# EAGLE schematic d-cs-8i-0-27 (EAGLE 6.6.0)
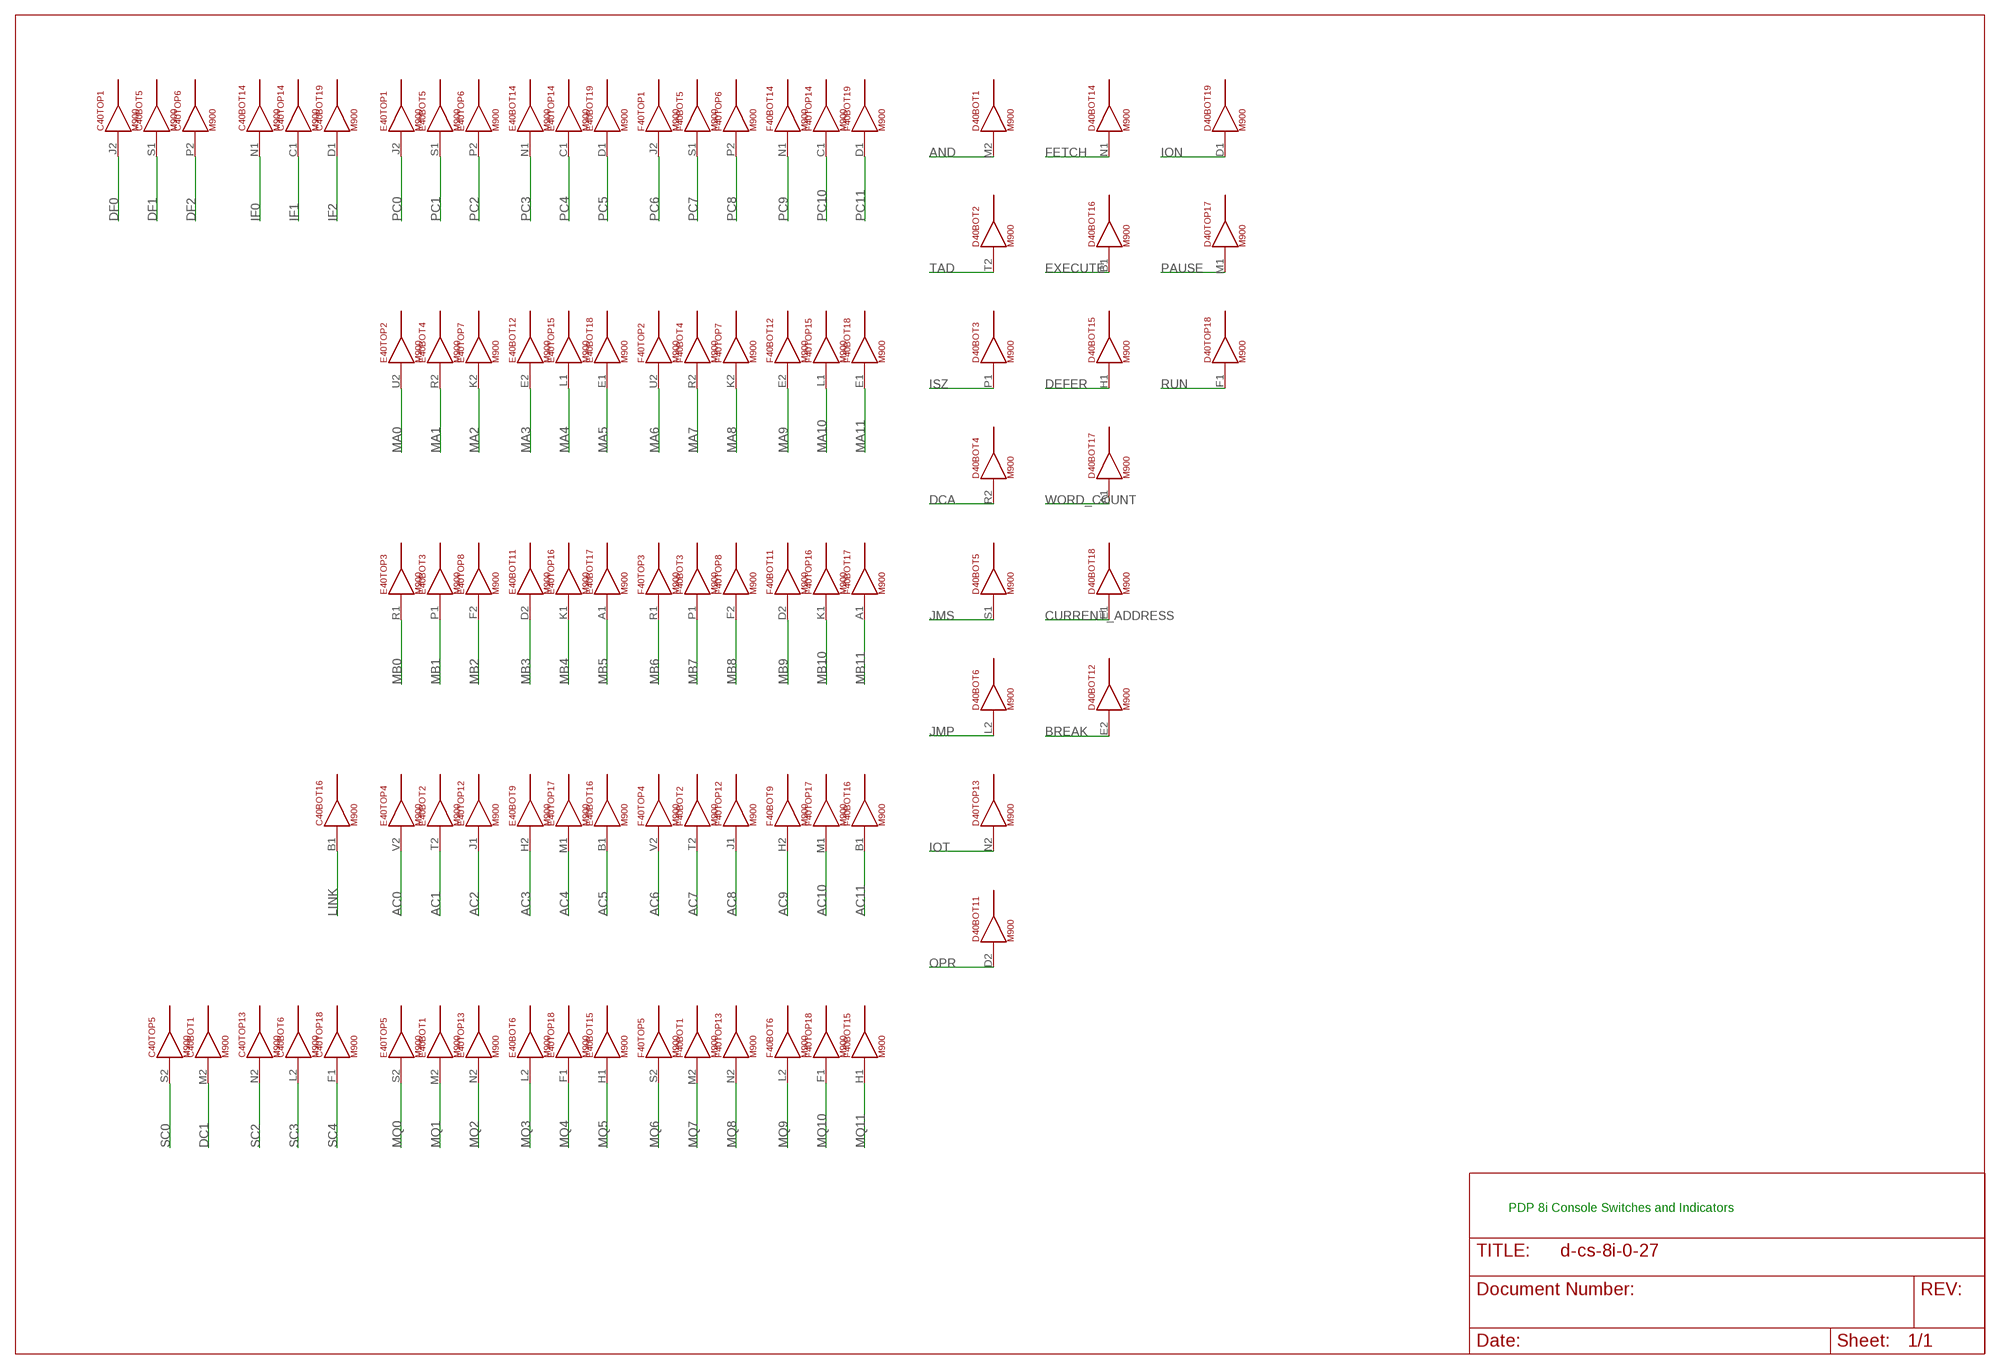
[diagram p0: schematic, sheet 1]

## Parts
C40  M900  [H807]
D40  M900  [H807]
E40  M900  [H807]
F40  M900  [H807]

## Nets
AC0: E40.V2
AC1: E40.T2
AC2: E40.J1
AC3: E40.H2
AC4: E40.M1
AC5: E40.B1
AC6: F40.V2
AC7: F40.T2
AC8: F40.J1
AC9: F40.H2
AC10: F40.M1
AC11: F40.B1
AND: D40.M2
BREAK: D40.E2
CURRENT_ADDRESS: D40.E1
DC1: C40.M2
DCA: D40.R2
DEFER: D40.H1
DF0: C40.J2
DF1: C40.S1
DF2: C40.P2
EXECUTE: D40.B1
FETCH: D40.N1
IF0: C40.N1
IF1: C40.C1
IF2: C40.D1
ION: D40.D1
IOT: D40.N2
ISZ: D40.P1
JMP: D40.L2
JMS: D40.S1
LINK: C40.B1
MA0: E40.U2
MA1: E40.R2
MA2: E40.K2
MA3: E40.E2
MA4: E40.L1
MA5: E40.E1
MA6: F40.U2
MA7: F40.R2
MA8: F40.K2
MA9: F40.E2
MA10: F40.L1
MA11: F40.E1
MB0: E40.R1
MB1: E40.P1
MB2: E40.F2
MB3: E40.D2
MB4: E40.K1
MB5: E40.A1
MB6: F40.R1
MB7: F40.P1
MB8: F40.F2
MB9: F40.D2
MB10: F40.K1
MB11: F40.A1
MQ0: E40.S2
MQ1: E40.M2
MQ2: E40.N2
MQ3: E40.L2
MQ4: E40.F1
MQ5: E40.H1
MQ6: F40.S2
MQ7: F40.M2
MQ8: F40.N2
MQ9: F40.L2
MQ10: F40.F1
MQ11: F40.H1
OPR: D40.D2
PAUSE: D40.M1
PC0: E40.J2
PC1: E40.S1
PC2: E40.P2
PC3: E40.N1
PC4: E40.C1
PC5: E40.D1
PC6: F40.J2
PC7: F40.S1
PC8: F40.P2
PC9: F40.N1
PC10: F40.C1
PC11: F40.D1
RUN: D40.F1
SC0: C40.S2
SC2: C40.N2
SC3: C40.L2
SC4: C40.F1
TAD: D40.T2
WORD_COUNT: D40.A1
Unconnected: C40.A1 C40.D2 C40.E1 C40.E2 C40.F2 C40.H1 C40.H2 C40.J1 C40.K1 C40.K2 C40.L1 C40.M1 C40.P1 C40.R1 C40.R2 C40.T2 C40.U2 C40.V2 D40.C1 D40.F2 D40.H2 D40.J1 D40.J2 D40.K1 D40.K2 D40.L1 D40.P2 D40.R1 D40.S2 D40.U2 D40.V2

## Notes on the sheet
- PDP 8i Console Switches and Indicators

## Power pins joined to a net without a drawn wire
GND: C40.C2(GND) C40.T1(GND) D40.C2(GND) D40.T1(GND) E40.C2(GND) E40.T1(GND) F40.C2(GND) F40.T1(GND)
VCC: C40.A2(VCC) D40.A2(VCC) E40.A2(VCC) F40.A2(VCC)

## Library data of the parts
C40 D40 E40 F40 = dec-m:M900: PDP-8/i Console Connector

## Net classes
1 Supply: width 0.762 mm